# EAGLE design wien (EAGLE 7.5.0)
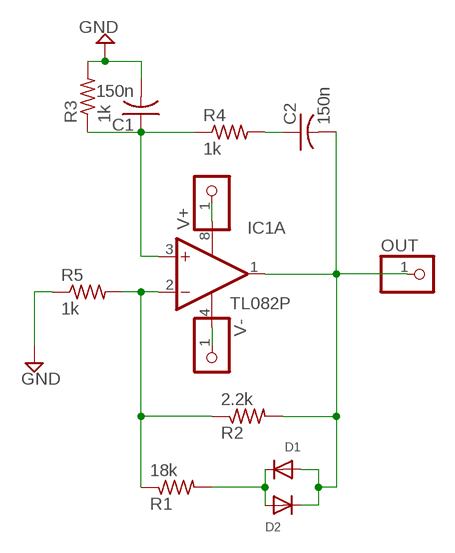
[diagram p0: schematic, sheet 1]

## Parts
C1  150n  C-US025-030X050  [C025-030X050]
C2  150n  C-US025-030X050  [C025-030X050]
D1  DIODEDO-1N4148  [DO-1N4148]
D2  DIODEDO-1N4148  [DO-1N4148]
IC1  TL082P  [DIL08]
OUT  PINHD-1X1CB  [1X01-CLEANBIG]
R1  18k  R-US_0207/12  [0207/12]
R2  2.2k  R-US_0207/12  [0207/12]
R3  1k  R-US_0207/12  [0207/12]
R4  1k  R-US_0207/12  [0207/12]
R5  1k  R-US_0207/12  [0207/12]
V+  PINHD-1X1CB  [1X01-CLEANBIG]
V-  PINHD-1X1CB  [1X01-CLEANBIG]

## Nets
GND: C1.2 R3.2 R5.1
N$1: C1.1 IC1.3(A:+IN) R3.1 R4.1
N$2: C2.1 R4.2
N$3: IC1.8(P:V+) V+.1
N$4: IC1.4(P:V-) V-.1
N$5: IC1.2(A:-IN) R1.1 R2.1 R5.2
N$6: D1.C D2.A R1.2
OUT: C2.2 D1.A D2.C IC1.1(A:OUT) OUT.1 R2.2
Unconnected: IC1.5(B:+IN) IC1.6(B:-IN) IC1.7(B:OUT)

## Library data of the parts
C1 C2 = adafruit:C-US: CAPACITOR, American symbol
D1 D2 = adafruit:DIODE: Diode SMADIODE - SMA Surface Mount Package 20V 1A Schottky Diode Digikey: 641-1014-6-ND DO-1N4148 - Through Hole Small Current Diode SOD-123 20V 1 A (.5mV Vf) Schottky Diode - Digikey: MBRX120TPMSCT-ND SOD-323 10V 570mA (.38mV Vf, 3ns) Schottky Diode - Digikey: ZLLS410CT-ND SOD-523 30V 30mA Schottky Diode (RB751S-40TE61) - Digikey: RB751S-40TE61CT-ND SOT23-R/W - SOT23 Package (R = Solder Paste/Reflow Ovens, W = Hand-Soldering) BAT54Film 40V 300mA - Digikey: 497-7162-1-ND
IC1 = linear:TL082: OP AMP Data sheet <http://www.ti.com/lit/ds/symlink/tl084a . pdf>; DATA_SHEET: <a href="http://www.ti.com/lit/ds/symlink/tl084a.pdf"> Data sheet </a>
OUT V+ V- = adafruit:PINHD-1X1: Pin header 1x1 for 0.1" spacing With round pins
R1-R5 = resistor:R-US_: RESISTOR, American symbol

## Board
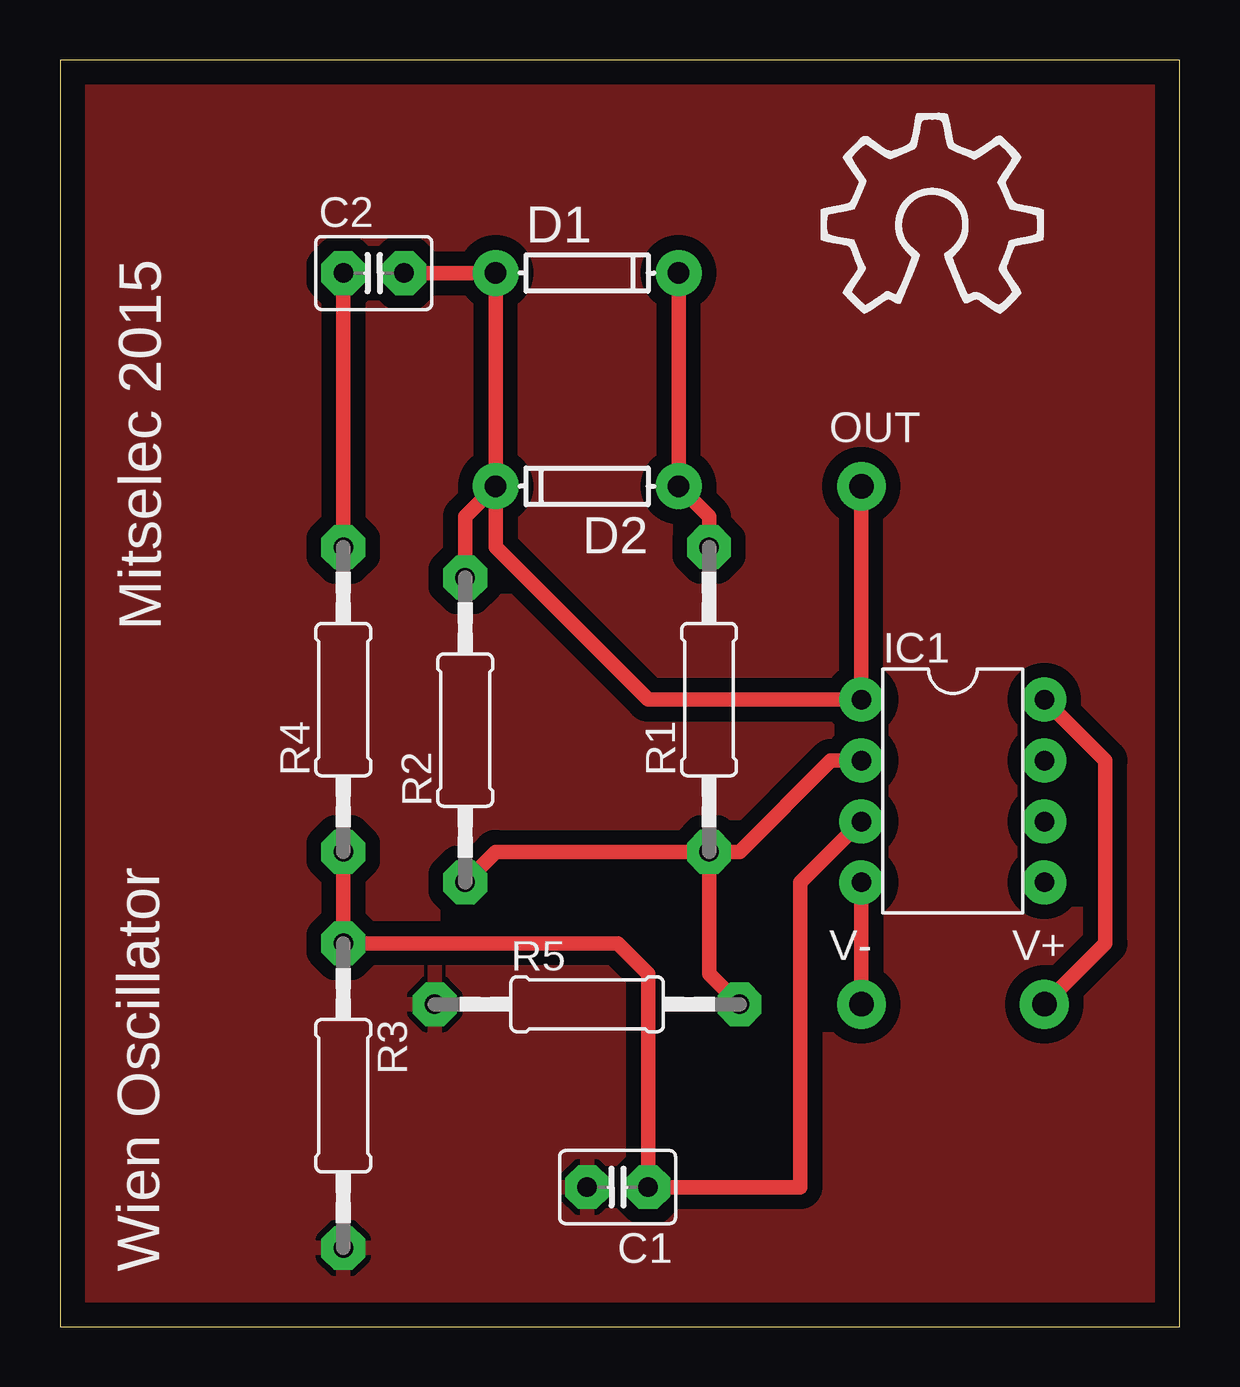
[diagram p1: board, top side]

Size 46.66 x 52.8 mm. Coordinates in mm from the lower left corner, seen from the top.
Outline: 0,0 46.66,0 46.66,52.8 0,52.8 0,0
Copper layers (1*16): Top 0.035mm / dielectric 1.5mm / Bottom 0.035mm
Design rules "default *": minimum track width 10mil, minimum drill 24mil, track to track 8mil, track to pad 8mil, pad to pad 8mil, via to via 8mil, smd to smd 8mil, copper to edge 40mil, drill to drill 0.3032mm, minimum pad ring 20mil, minimum via ring 8mil, stop-mask expansion 4mil, vias tented up to drill 0mil, thermal gap 10mil

### Footprints (pad centres in the part's own frame; a part is rotated, then mirrored left to right if it is on the bottom)
C025-030X050 = drill 0.813 pad 1.422 octagon: 1 -1.27,0; 2 1.27,0
DO-1N4148 = drill 0.9: A -3.81,0; C 3.81,0
DIL08 = drill 0.813 pad 1.27: 1 -3.81,-3.81; 2 -1.27,-3.81; 3 1.27,-3.81; 4 3.81,-3.81; 5 3.81,3.81; 6 1.27,3.81; 7 -1.27,3.81; 8 -3.81,3.81
1X01-CLEANBIG = drill 1.016 pad 1.778: 1 0,0
0207/12 = drill 0.813 octagon: 1 -6.35,0; 2 6.35,0

### Placement (x,y rotation side)
C1  23.23,5.82 180 top
C2  13.07,43.92 0 top
D1  21.96,43.92 0 top
D2  21.96,35.03 180 top
IC1  37.2,22.33 270 top
OUT  33.39,35.03 0 top
R1  27.04,26.14 90 top
R2  16.88,24.87 90 top
R3  11.8,9.63 270 top
R4  11.8,26.14 90 top
R5  21.96,13.44 0 top
V+  41.01,13.44 0 top
V-  33.39,13.44 0 top

### Tracks (layer width: path | path; a pad name or v marks a point on that pad's centre or on a via)
GND
  pour Top (isolate 0.61): -2.17,55.43 -2.17,-2.24 48.64,-2.31 48.64,55.35
N$1
  Top 0.61: IC1.3 30.85,18.52 30.85,5.82 C1.1 24.5,14.71 23.23,15.98 R3.1 R4.1
N$2
  Top 0.61: C2.1 R4.2
N$3
  Top 0.61: V+.1 43.55,15.98 43.55,23.6 IC1.8
N$4
  Top 0.61: IC1.4 V-.1
N$5
  Top 0.61: R1.1 28.31,19.79 32.12,23.6 IC1.2 | R5.2 27.04,14.71 R1.1 | R2.1 18.15,19.79 R1.1
N$6
  Top 0.61: R1.2 27.04,33.76 D2.A D1.C
OUT
  Top 0.61: C2.2 D1.A D2.C | R2.2 16.88,33.76 D2.C | D2.C 18.15,32.49 24.5,26.14 IC1.1 OUT.1

### Text on the board
tPlace: Mitselec 2015 | Wien Oscillator